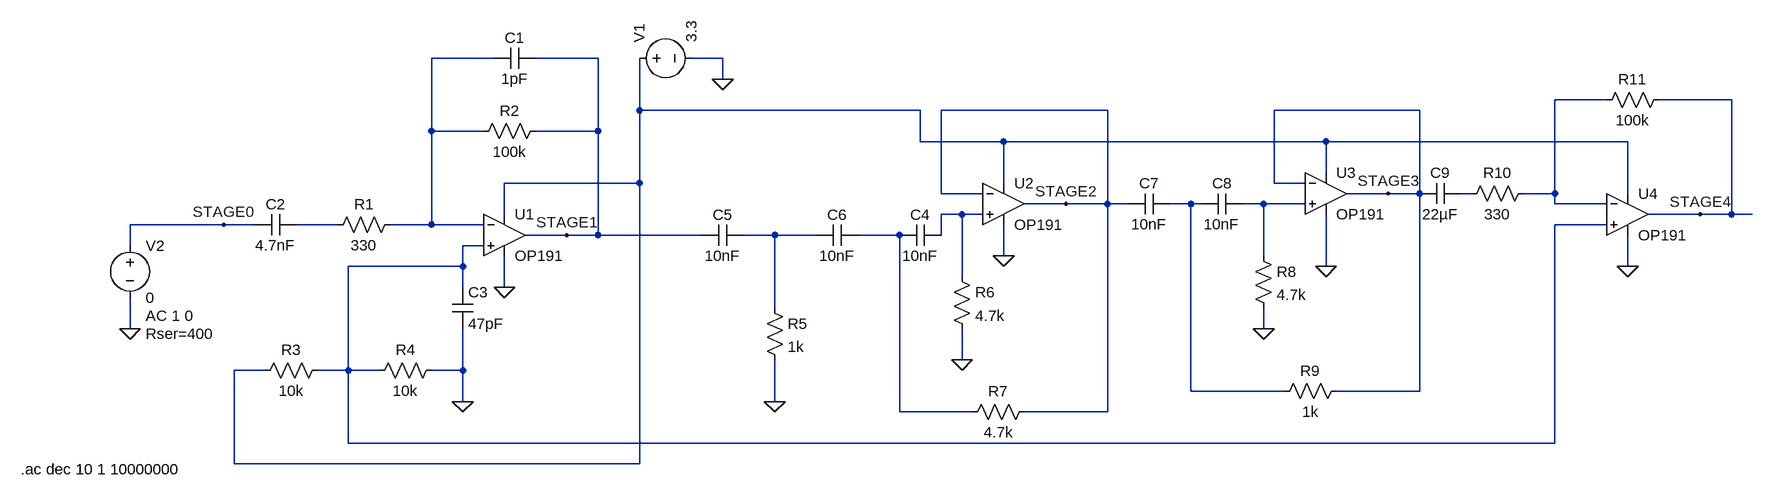
[diagram p0: schematic mic_sim_butterworth_2ndorder_4stages.asc]
mic_sim_butterworth_2ndorder_4stages.asc, the LTspice schematic file:
Version 4
SHEET 1 3312 680
WIRE 848 -16 752 -16
WIRE 1008 -16 912 -16
WIRE 1200 -16 1152 -16
WIRE 1200 16 1200 -16
WIRE 2560 48 2480 48
WIRE 2752 48 2640 48
WIRE 1072 64 1072 -16
WIRE 1504 64 1072 64
WIRE 1792 64 1536 64
WIRE 2272 64 2048 64
WIRE 752 96 752 -16
WIRE 832 96 752 96
WIRE 1008 96 1008 -16
WIRE 1008 96 912 96
WIRE 1504 112 1504 64
WIRE 1632 112 1504 112
WIRE 2128 112 1632 112
WIRE 2592 112 2128 112
WIRE 2128 160 2128 112
WIRE 1072 176 1072 64
WIRE 1072 176 864 176
WIRE 1632 176 1632 112
WIRE 2048 176 2048 64
WIRE 2096 176 2048 176
WIRE 1536 192 1536 64
WIRE 1600 192 1536 192
WIRE 2224 192 2160 192
WIRE 2272 192 2272 64
WIRE 2272 192 2224 192
WIRE 2352 192 2336 192
WIRE 2480 192 2480 48
WIRE 2480 192 2432 192
WIRE 2592 192 2592 112
WIRE 1728 208 1664 208
WIRE 1792 208 1792 64
WIRE 1792 208 1728 208
WIRE 1824 208 1792 208
WIRE 1920 208 1888 208
WIRE 1936 208 1920 208
WIRE 2032 208 2000 208
WIRE 2096 208 2032 208
WIRE 2480 208 2480 192
WIRE 2560 208 2480 208
WIRE 864 224 864 176
WIRE 1568 224 1536 224
WIRE 1600 224 1568 224
WIRE 2704 224 2624 224
WIRE 2752 224 2752 48
WIRE 2752 224 2704 224
WIRE 2784 224 2752 224
WIRE 432 240 288 240
WIRE 480 240 432 240
WIRE 608 240 544 240
WIRE 752 240 752 96
WIRE 752 240 688 240
WIRE 832 240 752 240
WIRE 2560 240 2480 240
WIRE 960 256 896 256
WIRE 1008 256 1008 96
WIRE 1008 256 960 256
WIRE 1168 256 1008 256
WIRE 1280 256 1232 256
WIRE 1344 256 1280 256
WIRE 1472 256 1408 256
WIRE 1536 256 1536 224
WIRE 288 272 288 240
WIRE 832 272 800 272
WIRE 1632 288 1632 240
WIRE 2032 288 2032 208
WIRE 800 304 800 272
WIRE 800 304 624 304
WIRE 2128 304 2128 224
WIRE 2592 304 2592 256
WIRE 1568 320 1568 224
WIRE 800 336 800 304
WIRE 864 336 864 288
WIRE 1280 368 1280 256
WIRE 288 400 288 352
WIRE 2032 400 2032 368
WIRE 1568 448 1568 400
WIRE 496 464 448 464
WIRE 624 464 624 304
WIRE 624 464 576 464
WIRE 672 464 624 464
WIRE 800 464 800 400
WIRE 800 464 752 464
WIRE 1920 496 1920 208
WIRE 2064 496 1920 496
WIRE 2272 496 2272 192
WIRE 2272 496 2144 496
WIRE 800 512 800 464
WIRE 1280 512 1280 448
WIRE 1472 528 1472 256
WIRE 1584 528 1472 528
WIRE 1792 528 1792 208
WIRE 1792 528 1664 528
WIRE 624 576 624 464
WIRE 2480 576 2480 240
WIRE 2480 576 624 576
WIRE 448 608 448 464
WIRE 1072 608 1072 176
WIRE 1072 608 448 608
FLAG 800 512 0
FLAG 864 336 0
FLAG 1200 16 0
FLAG 288 400 0
FLAG 1568 448 0
FLAG 1632 288 0
FLAG 1280 512 0
FLAG 2128 304 0
FLAG 960 256 STAGE1
FLAG 1728 208 STAGE2
FLAG 2224 192 STAGE3
FLAG 2032 400 0
FLAG 2592 304 0
FLAG 2704 224 STAGE4
FLAG 432 240 STAGE0
SYMBOL res 704 224 R90
WINDOW 0 0 56 VBottom 2
WINDOW 3 32 56 VTop 2
SYMATTR InstName R1
SYMATTR Value 330
SYMBOL res 928 80 R90
WINDOW 0 0 56 VBottom 2
WINDOW 3 32 56 VTop 2
SYMATTR InstName R2
SYMATTR Value 100k
SYMBOL res 592 448 R90
WINDOW 0 0 56 VBottom 2
WINDOW 3 32 56 VTop 2
SYMATTR InstName R3
SYMATTR Value 10k
SYMBOL res 768 448 R90
WINDOW 0 0 56 VBottom 2
WINDOW 3 32 56 VTop 2
SYMATTR InstName R4
SYMATTR Value 10k
SYMBOL cap 544 224 R90
WINDOW 0 0 32 VBottom 2
WINDOW 3 32 32 VTop 2
SYMATTR InstName C2
SYMATTR Value 4.7nF
SYMBOL cap 784 336 R0
SYMATTR InstName C3
SYMATTR Value 47pF
SYMBOL OpAmps\\OP191 864 192 R0
SYMATTR InstName U1
SYMBOL voltage 1056 -16 R270
WINDOW 123 0 0 Left 0
WINDOW 39 0 0 Left 0
SYMATTR InstName V1
SYMATTR Value 3.3
SYMBOL voltage 288 256 R0
WINDOW 123 24 124 Left 2
WINDOW 39 24 152 Left 2
SYMATTR Value2 AC 1 0
SYMATTR SpiceLine Rser=400
SYMATTR InstName V2
SYMATTR Value 0
SYMBOL cap 912 -32 R90
WINDOW 0 0 32 VBottom 2
WINDOW 3 32 32 VTop 2
SYMATTR InstName C1
SYMATTR Value 1pF
SYMBOL OpAmps\\OP191 1632 144 R0
SYMATTR InstName U2
SYMBOL cap 1536 240 R90
WINDOW 0 0 32 VBottom 2
WINDOW 3 32 32 VTop 2
SYMATTR InstName C4
SYMATTR Value 10nF
SYMBOL cap 1232 240 R90
WINDOW 0 0 32 VBottom 2
WINDOW 3 32 32 VTop 2
SYMATTR InstName C5
SYMATTR Value 10nF
SYMBOL res 1264 352 R0
SYMATTR InstName R5
SYMATTR Value 1k
SYMBOL res 1552 304 R0
SYMATTR InstName R6
SYMATTR Value 4.7k
SYMBOL res 1680 512 R90
WINDOW 0 0 56 VBottom 2
WINDOW 3 32 56 VTop 2
SYMATTR InstName R7
SYMATTR Value 4.7k
SYMBOL cap 1408 240 R90
WINDOW 0 0 32 VBottom 2
WINDOW 3 32 32 VTop 2
SYMATTR InstName C6
SYMATTR Value 10nF
SYMBOL OpAmps\\OP191 2128 128 R0
SYMATTR InstName U3
SYMBOL cap 1888 192 R90
WINDOW 0 0 32 VBottom 2
WINDOW 3 32 32 VTop 2
SYMATTR InstName C7
SYMATTR Value 10nF
SYMBOL cap 2000 192 R90
WINDOW 0 0 32 VBottom 2
WINDOW 3 32 32 VTop 2
SYMATTR InstName C8
SYMATTR Value 10nF
SYMBOL res 2016 272 R0
SYMATTR InstName R8
SYMATTR Value 4.7k
SYMBOL res 2048 512 R270
WINDOW 0 32 56 VTop 2
WINDOW 3 0 56 VBottom 2
SYMATTR InstName R9
SYMATTR Value 1k
SYMBOL OpAmps\\OP191 2592 160 R0
SYMATTR InstName U4
SYMBOL res 2448 176 R90
WINDOW 0 0 56 VBottom 2
WINDOW 3 32 56 VTop 2
SYMATTR InstName R10
SYMATTR Value 330
SYMBOL res 2656 32 R90
WINDOW 0 0 56 VBottom 2
WINDOW 3 32 56 VTop 2
SYMATTR InstName R11
SYMATTR Value 100k
SYMBOL cap 2336 176 R90
WINDOW 0 0 32 VBottom 2
WINDOW 3 32 32 VTop 2
SYMATTR InstName C9
SYMATTR Value 22µF
TEXT 120 616 Left 2 !.ac dec 10 1 10000000

The netlist it stands for:
* mic_sim_butterworth_2ndorder_4stages.asc
R1 N001 N008 330
R2 STAGE1 N001 100k
R3 N009 N003 10k
R4 0 N009 10k
C2 N008 STAGE0 4.7nF
C3 N009 0 47pF
XU1 N009 N001 N003 0 STAGE1 OP191  ; pins In+ In- V+ V- OUT
V1 N003 0 3.3
V2 STAGE0 0 0 AC 1 0 Rser=400
C1 STAGE1 N001 1pF
XU2 N007 STAGE2 N003 0 STAGE2 OP191  ; pins In+ In- V+ V- OUT
C4 N007 N011 10nF
C5 N010 STAGE1 10nF
R5 N010 0 1k
R6 N007 0 4.7k
R7 STAGE2 N011 4.7k
C6 N011 N010 10nF
XU3 N006 STAGE3 N003 0 STAGE3 OP191  ; pins In+ In- V+ V- OUT
C7 N005 STAGE2 10nF
C8 N006 N005 10nF
R8 N006 0 4.7k
R9 N005 STAGE3 1k
XU4 N009 N002 N003 0 STAGE4 OP191  ; pins In+ In- V+ V- OUT
R10 N002 N004 330
R11 STAGE4 N002 100k
C9 N004 STAGE3 22µF
.ac dec 10 1 10000000
.lib ADI.lib
.backanno
.end